# Altium schematic sheet My_esp.SchDoc
size 420 x 297 mm; SheetNumber: 1; SheetTotal: 1
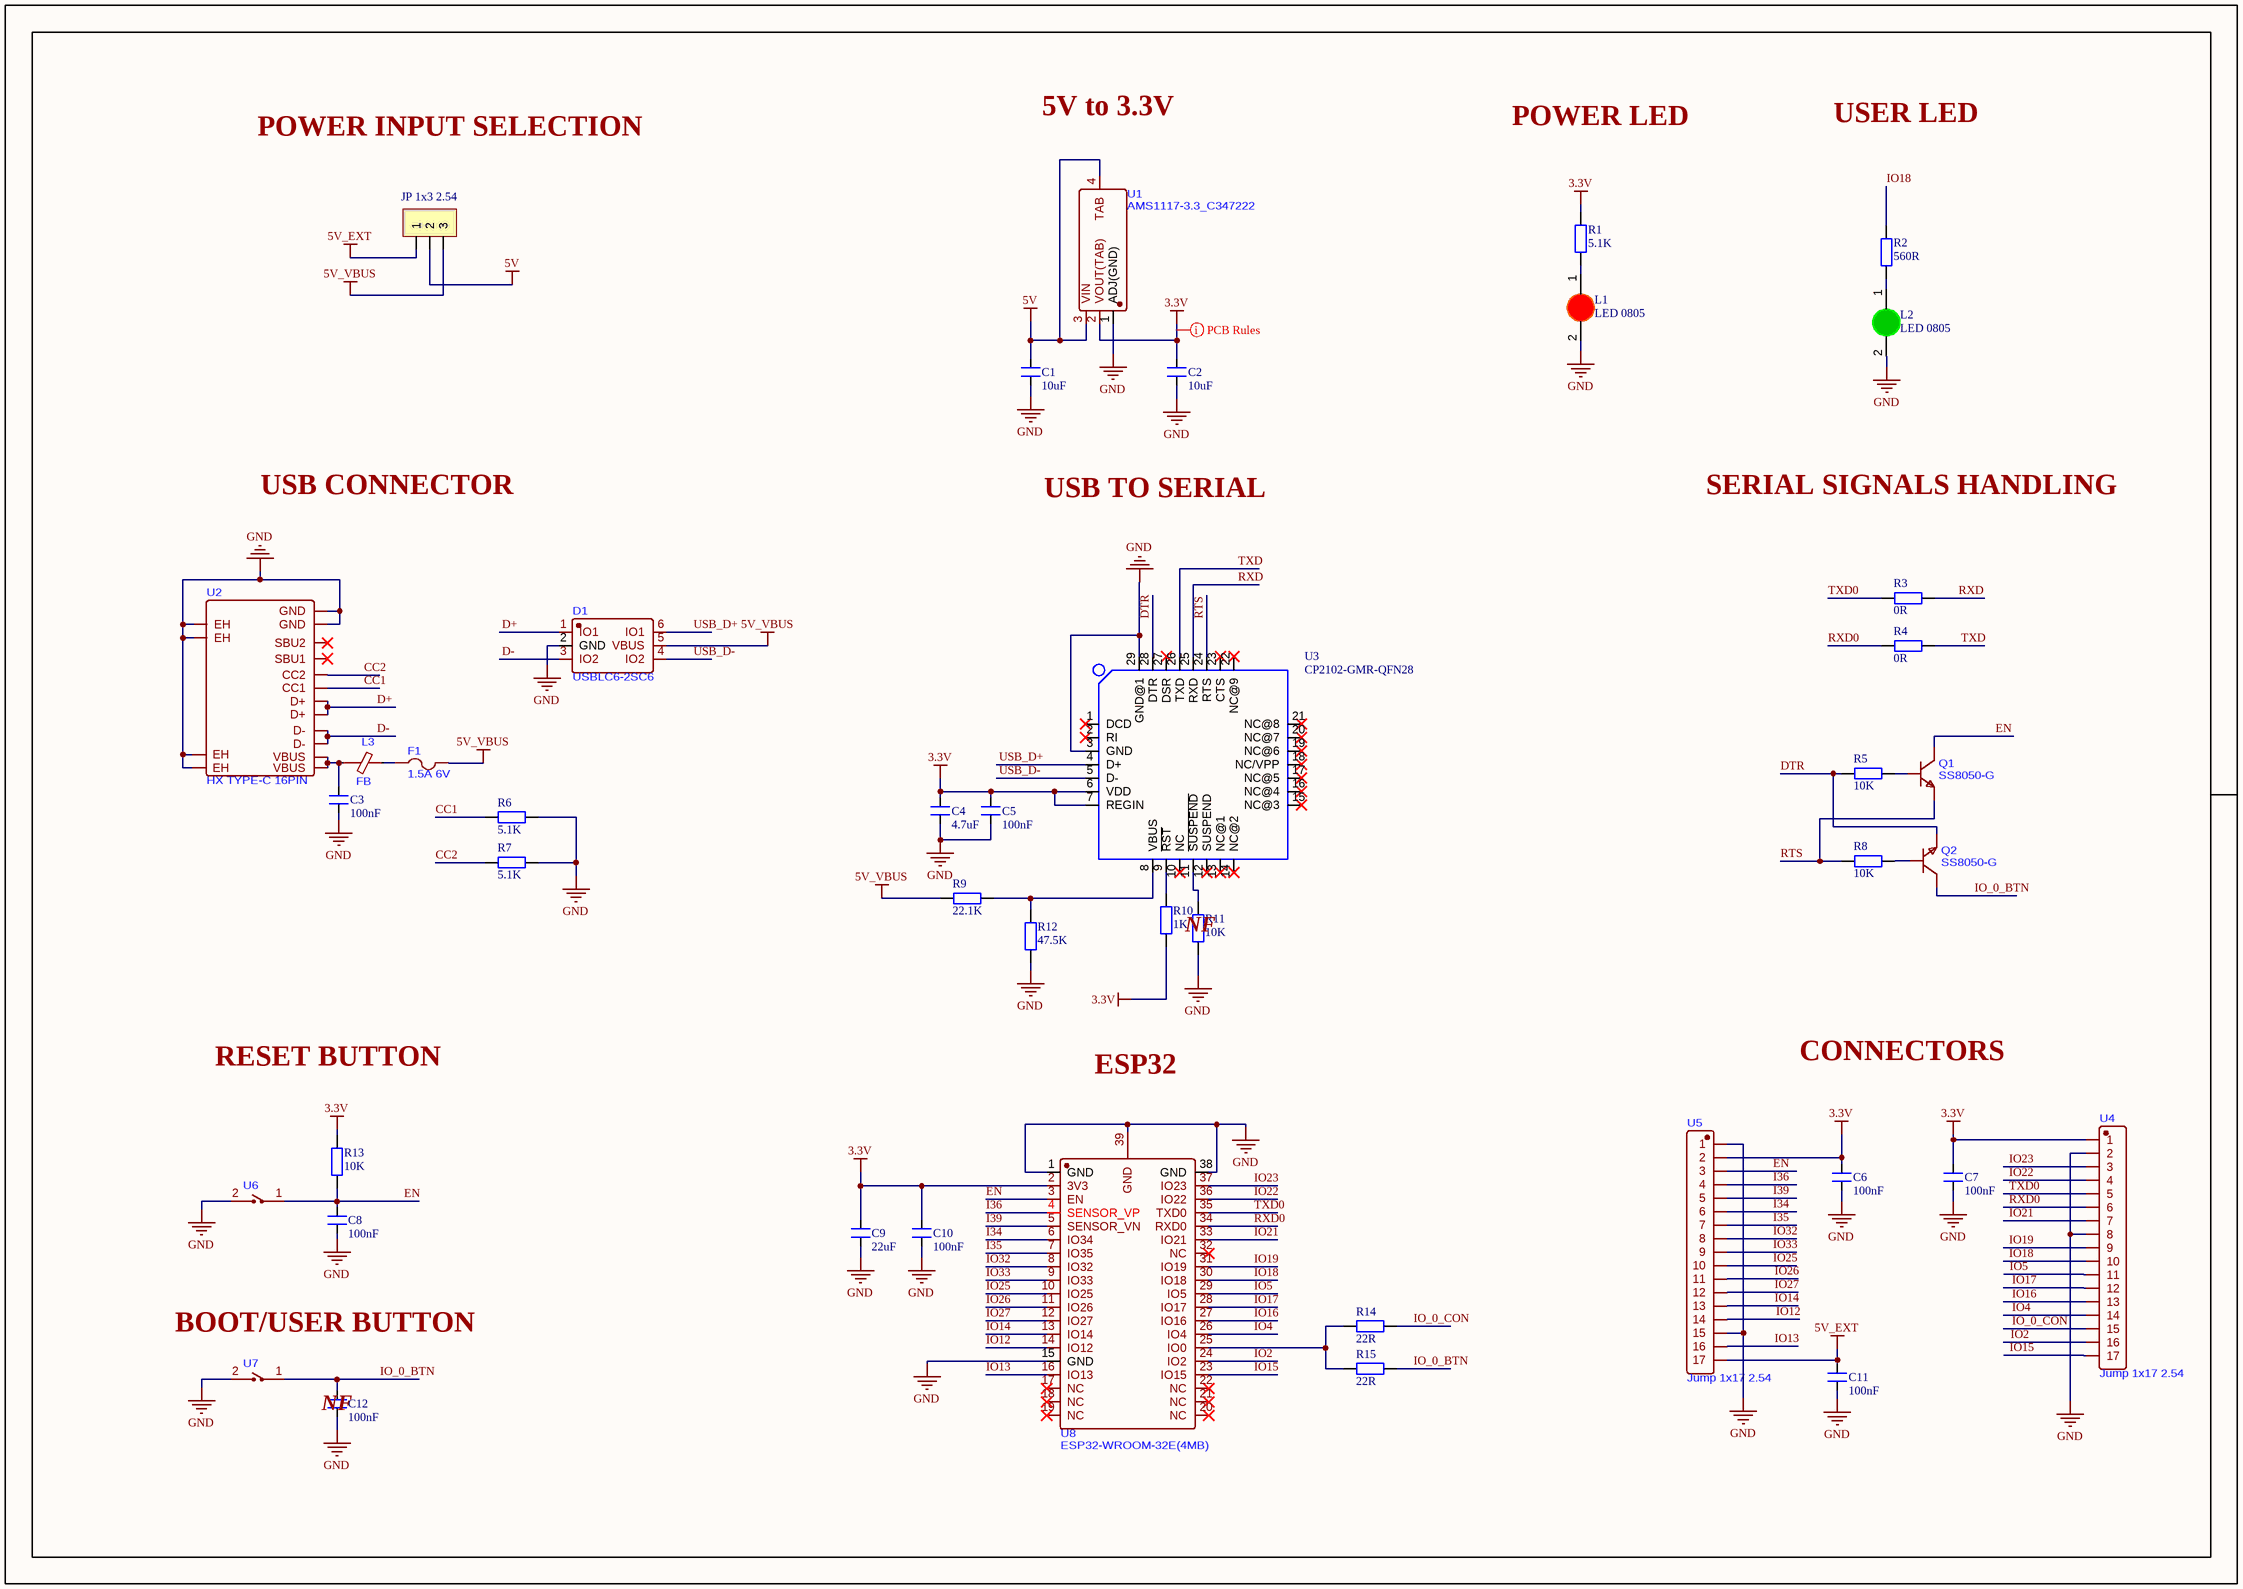
[diagram p0: My_esp.SchDoc]

## Parts
C1  10uF  [SM-0805]
C2  10uF  [SM-0805]
C3  100nF  [SM-0805]
C4  4.7uF  [SM-0805]
C5  100nF  [SM-0805]
C6  100nF  [SM-0805]
C7  100nF  [SM-0805]
C8  100nF  [SM-0805]
C9  22uF  [SM-0805]
C10  100nF  [SM-0805]
C11  100nF  [SM-0805]
C12  100nF  [SM-0805]
D1  USBLC6-2SC6  [SOT-23-6_L2.9-W1.6-P0.95-LS2.8-BL]
F1  1.5A 6V  [R1206]
JP1  JP 1x3 2.54  [JP 1x3 DT]
L1  LED 0805  [LED-0805-Red]
L2  LED 0805  [LED-0805-Green]
L3  FB  [L0805]
Q1  SS8050-G  [SOT-23-3_L2.9-W1.3-P1.90-LS2.4-BR]
Q2  SS8050-G  [SOT-23-3_L2.9-W1.3-P1.90-LS2.4-BR]
R1  5.1K  [SM-0805]
R2  560R  [SM-0805]
R3  0R  [SM-0805]
R4  0R  [SM-0805]
R5  10K  [SM-0805]
R6  5.1K  [SM-0805]
R7  5.1K  [SM-0805]
R8  10K  [SM-0805]
R9  22.1K  [SM-0805]
R10  1K  [SM-0805]
R11  10K  [SM-0805]
R12  47.5K  [SM-0805]
R13  10K  [SM-0805]
R14  22R  [SM-0805]
R15  22R  [SM-0805]
U1  AMS1117-3.3_C347222  [SOT-223-4_L6.5-W3.5-P2.30-LS7.0-BR]
U2  HX TYPE-C 16PIN  [TYPE-C-SMD_HX-TYPE-C-16PIN]
U3  CP2102-GMR-QFN28  [QFN28G_0.5-5X5MM]
U4  Jump 1x17 2.54  [HDR-TH_17P-P2.54-V-M]
U5  Jump 1x17 2.54  [HDR-TH_17P-P2.54-V-M]
U6  Sw 2 chan 3X6X2.5MM  [SW-SMD_L6.1-W3.7-LS8.0]  (value not drawn)
U7  Sw 2 chan 3X6X2.5MM  [SW-SMD_L6.1-W3.7-LS8.0]  (value not drawn)
U8  ESP32-WROOM-32E(4MB)  [WIFI-SMD_ESP32-WROOM-32E]

## Nets
3.3V: C2.2 C4.2 C5.2 C6.2 C7.2 C9.2 C10.2 R1.1 R10.1 R13.2 U1.2(VOUT(TAB)) U3.6(VDD) U3.7(REGIN) U4.1 U5.2 U8.2(3V3)
5V: C1.2 JP1.2 U1.3(VIN) U1.4(TAB)
5V_EXT: C11.2 JP1.1 U5.17
5V_VBUS: D1.5(VBUS) F1.2 JP1.3 R9.2
GND: C1.1 C2.1 C3.1 C4.1 C5.1 C6.1 C7.1 C8.1 C9.1 C10.1 C11.1 C12.1 D1.2(GND) L1.2(K) L2.2(K) R6.1 R7.1 R11.1 R12.1 U1.1(ADJ(GND)) U2.17(EH) U2.18(EH) U2.19(EH) U2.20(EH) U2.A12B1(GND) U2.B12A1(GND) U3.3(GND) U3.29(GND@1) U4.2 U4.8 U5.1 U5.15 U6.2 U7.2 U8.1(GND) U8.15(GND) U8.38(GND) U8.39(GND)
CC1: R6.2 U2.A5(CC1)
CC2: R7.2 U2.B5(CC2)
D+: D1.1(IO1) U2.A6(D+) U2.B6(D+)
D-: D1.3(IO2) U2.A7(D-) U2.B7(D-)
DTR: Q2.2(E) R5.1 U3.28(DTR)
EN: C8.2 Q1.3(C) R13.1 U5.3 U6.1 U8.3(EN)
I34: U5.6 U8.6(IO34)
I35: U5.7 U8.7(IO35)
I36: U5.4 U8.4(SENSOR_VP)
I39: U5.5 U8.5(SENSOR_VN)
IO2: U4.16 U8.24(IO2)
IO4: U4.14 U8.26(IO4)
IO5: U4.11 U8.29(IO5)
IO12: U5.14 U8.14(IO12)
IO13: U5.16 U8.16(IO13)
IO14: U5.13 U8.13(IO14)
IO15: U4.17 U8.23(IO15)
IO16: U4.13 U8.27(IO16)
IO17: U4.12 U8.28(IO17)
IO18: R2.1 U4.10 U8.30(IO18)
IO19: U4.9 U8.31(IO19)
IO21: U4.7 U8.33(IO21)
IO22: U4.4 U8.36(IO22)
IO23: U4.3 U8.37(IO23)
IO25: U5.10 U8.10(IO25)
IO26: U5.11 U8.11(IO26)
IO27: U5.12 U8.12(IO27)
IO32: U5.8 U8.8(IO32)
IO33: U5.9 U8.9(IO33)
IO_0_BTN: C12.2 Q2.3(C) R15.2 U7.1
IO_0_CON: R14.2 U4.15
RTS: Q1.2(E) R8.1 U3.24(RTS)
RXD: R3.2 U3.25(RXD)
RXD0: R4.1 U4.6 U8.34(RXD0)
TXD: R4.2 U3.26(TXD)
TXD0: R3.1 U4.5 U8.35(TXD0)
USB_D+: D1.6(IO1) U3.4(D+)
USB_D-: D1.4(IO2) U3.5(D-)
NetC3_2: C3.2 L3.2 U2.A9B4(VBUS) U2.B9A4(VBUS)
NetF1_1: F1.1 L3.1
NetL1_1: L1.1(A) R1.2
NetL2_1: L2.1(A) R2.2
NetQ1_1: Q1.1(B) R5.2
NetQ2_1: Q2.1(B) R8.2
NetR9_1: R9.1 R12.2 U3.8(VBUS)
NetR10_2: R10.2 U3.9(~{RST})
NetR11_2: R11.2 U3.11(~{SUSPEND})
NetR14_1: R14.1 R15.1 U8.25(IO0)

Not connected (* = marked no-connect by the designer): U2 A8(SBU1)* B8(SBU2)*; U3 1(DCD)* 2(RI)* 10(NC)* 12(SUSPEND)* 13(NC@1)* 14(NC@2)* 15(NC@3)* 16(NC@4)* 17(NC@5)* 18(NC/VPP)* 19(NC@6)* 20(NC@7)* 21(NC@8)* 22(NC@9)* 23(CTS)* 27(DSR)*; U8 17(NC)* 18(NC)* 19(NC)* 20(NC)* 21(NC)* 22(NC)* 32(NC)*

## Layout directives
rule Width Constraint [Pref Width = 20mil    Min Width = 20mil    Max Width = 20mil]; rule Routing Via Style [Pref Size = 20mil    Pref Hole Size = 12mil]: 3.3V

## Notes on the sheet
- 5V to 3.3V
- USER LED
- POWER INPUT SELECTION
- POWER LED
- USB CONNECTOR
- USB TO SERIAL
- SERIAL SIGNALS HANDLING
- (near R11) NF
- RESET BUTTON
- CONNECTORS
- ESP32
- BOOT/USER BUTTON
- (near C12) NF

## Library data of the parts
C1-C12 = Tu: Cap SMD; Value: 103
F1 = Cau tri tu phuc hoi: 1.5A 6V SMD
JP1 = JP 1x3 2.54 Duc Thang: Cắm; Ten_Linh_Kien: Jump Đơn Đực 2.54MM 1x40P Thẳng 11MM; Don_Vi: Con; Ma_Hang: MH000903; Ghi_Chu: *; Kieu_Chan: *; Chung_Loai: Cắm
L1 = LED 0805 Do: Dán; Don_Vi: Con; Ma_Hang: MH000897; Ten_Linh_Kien: LED 0805 Màu Đỏ (Red); Ghi_Chu: *; Kieu_Chan: *; Chung_Loai: Dán
L2 = LED 0805 Xanh La: Dán; Don_Vi: Con; Ma_Hang: MH002326; Ten_Linh_Kien: LED 0805 Màu Xanh Lá (Green); Ghi_Chu: *; Kieu_Chan: *; Chung_Loai: Dán
L3 = FerriteBead
R1-R9 R11-R15 = RM: Resistor SMD; Value: 1K
R10 = RM: Resistor SMD; Value: 1K
U3 = CP2102-GMR-QFN28: USB Bridge, USB to UART USB 2.0 UART Interface 28-QFN (5x5); MF: Silicon Labs; Purchase-URL: https://pricing.snapeda.com/search/part/CP2102-GMR/?ref=eda; MP: CP2102-GMR; SnapEDA_Link: https://www.snapeda.com/parts/CP2102-GMR/Silicon%20Labs/view-part/105743/?ref=snap; Price: None; Package: VFQFN-28 Silicon Labs; Check_prices: https://www.snapeda.com/parts/CP2102-GMR/Silicon%20Labs/view-part/105743/?ref=eda; Value: *; Availability: Warning